# Altium schematic sheet x-IMU3-SA-Light.SchDoc
size A4; SheetNumber: 1; SheetTotal: 1
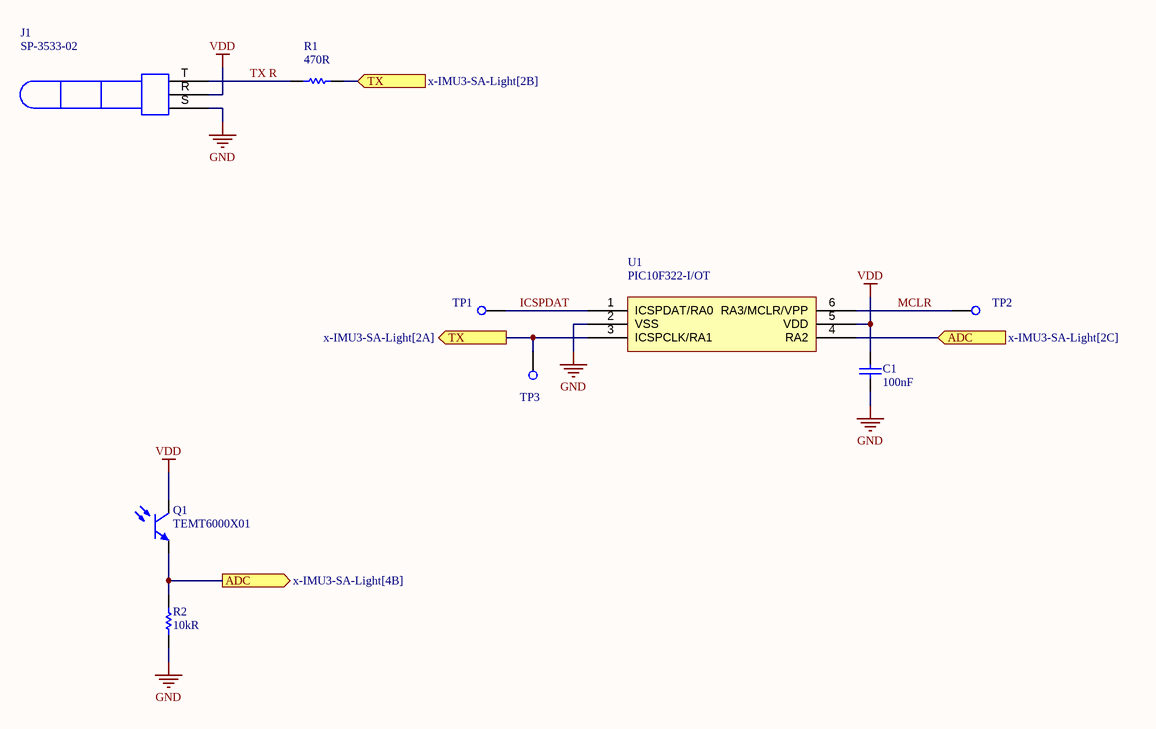
[diagram p0: x-IMU3-SA-Light.SchDoc]

## Parts
C1  100nF  [Capacitor 0402]
J1  SP-3533-02  [SP-3533-02]
Q1  TEMT6000X01  [TEMT6000X01]
R1  470R  [Resistor 0402]
R2  10kR  [Resistor 0402]
TP1  Test Point  [Test Point 1mm]  (value not drawn)
TP2  Test Point  [Test Point 1mm]  (value not drawn)
TP3  Test Point  [Test Point 1mm]  (value not drawn)
U1  PIC10F322-I/OT  [SOT-23-6]

## Ports
ADC (in, see x-IMU3-SA-Light[2C]), ADC (out, see x-IMU3-SA-Light[4B]), TX (in, see x-IMU3-SA-Light[2B]), TX (out, see x-IMU3-SA-Light[2A])

## Nets
GND: C1.1 J1.S R2.1 U1.2(VSS)
VDD: C1.2 J1.R Q1.Collector U1.5(VDD)
ADC: Q1.Emitter R2.2 U1.4(RA2) ; port ADC
ICSPDAT: TP1.1 U1.1(ICSPDAT/RA0)
MCLR: TP2.1 U1.6(RA3/MCLR/VPP)
TX: R1.2 TP3.1 U1.3(ICSPCLK/RA1) ; port TX
TX R: J1.T R1.1

## Notes on the sheet
- TITLE
- SIZE
- A4
- VARIANT
- PROJECT
- SHEET
- VERSION
- OF
- AUTHOR
- DATE

## Library data of the parts
C1 = Capacitor
R1 R2 = Resistor